# EAGLE design GanglionCarrierBoard (EAGLE 8.3.0)
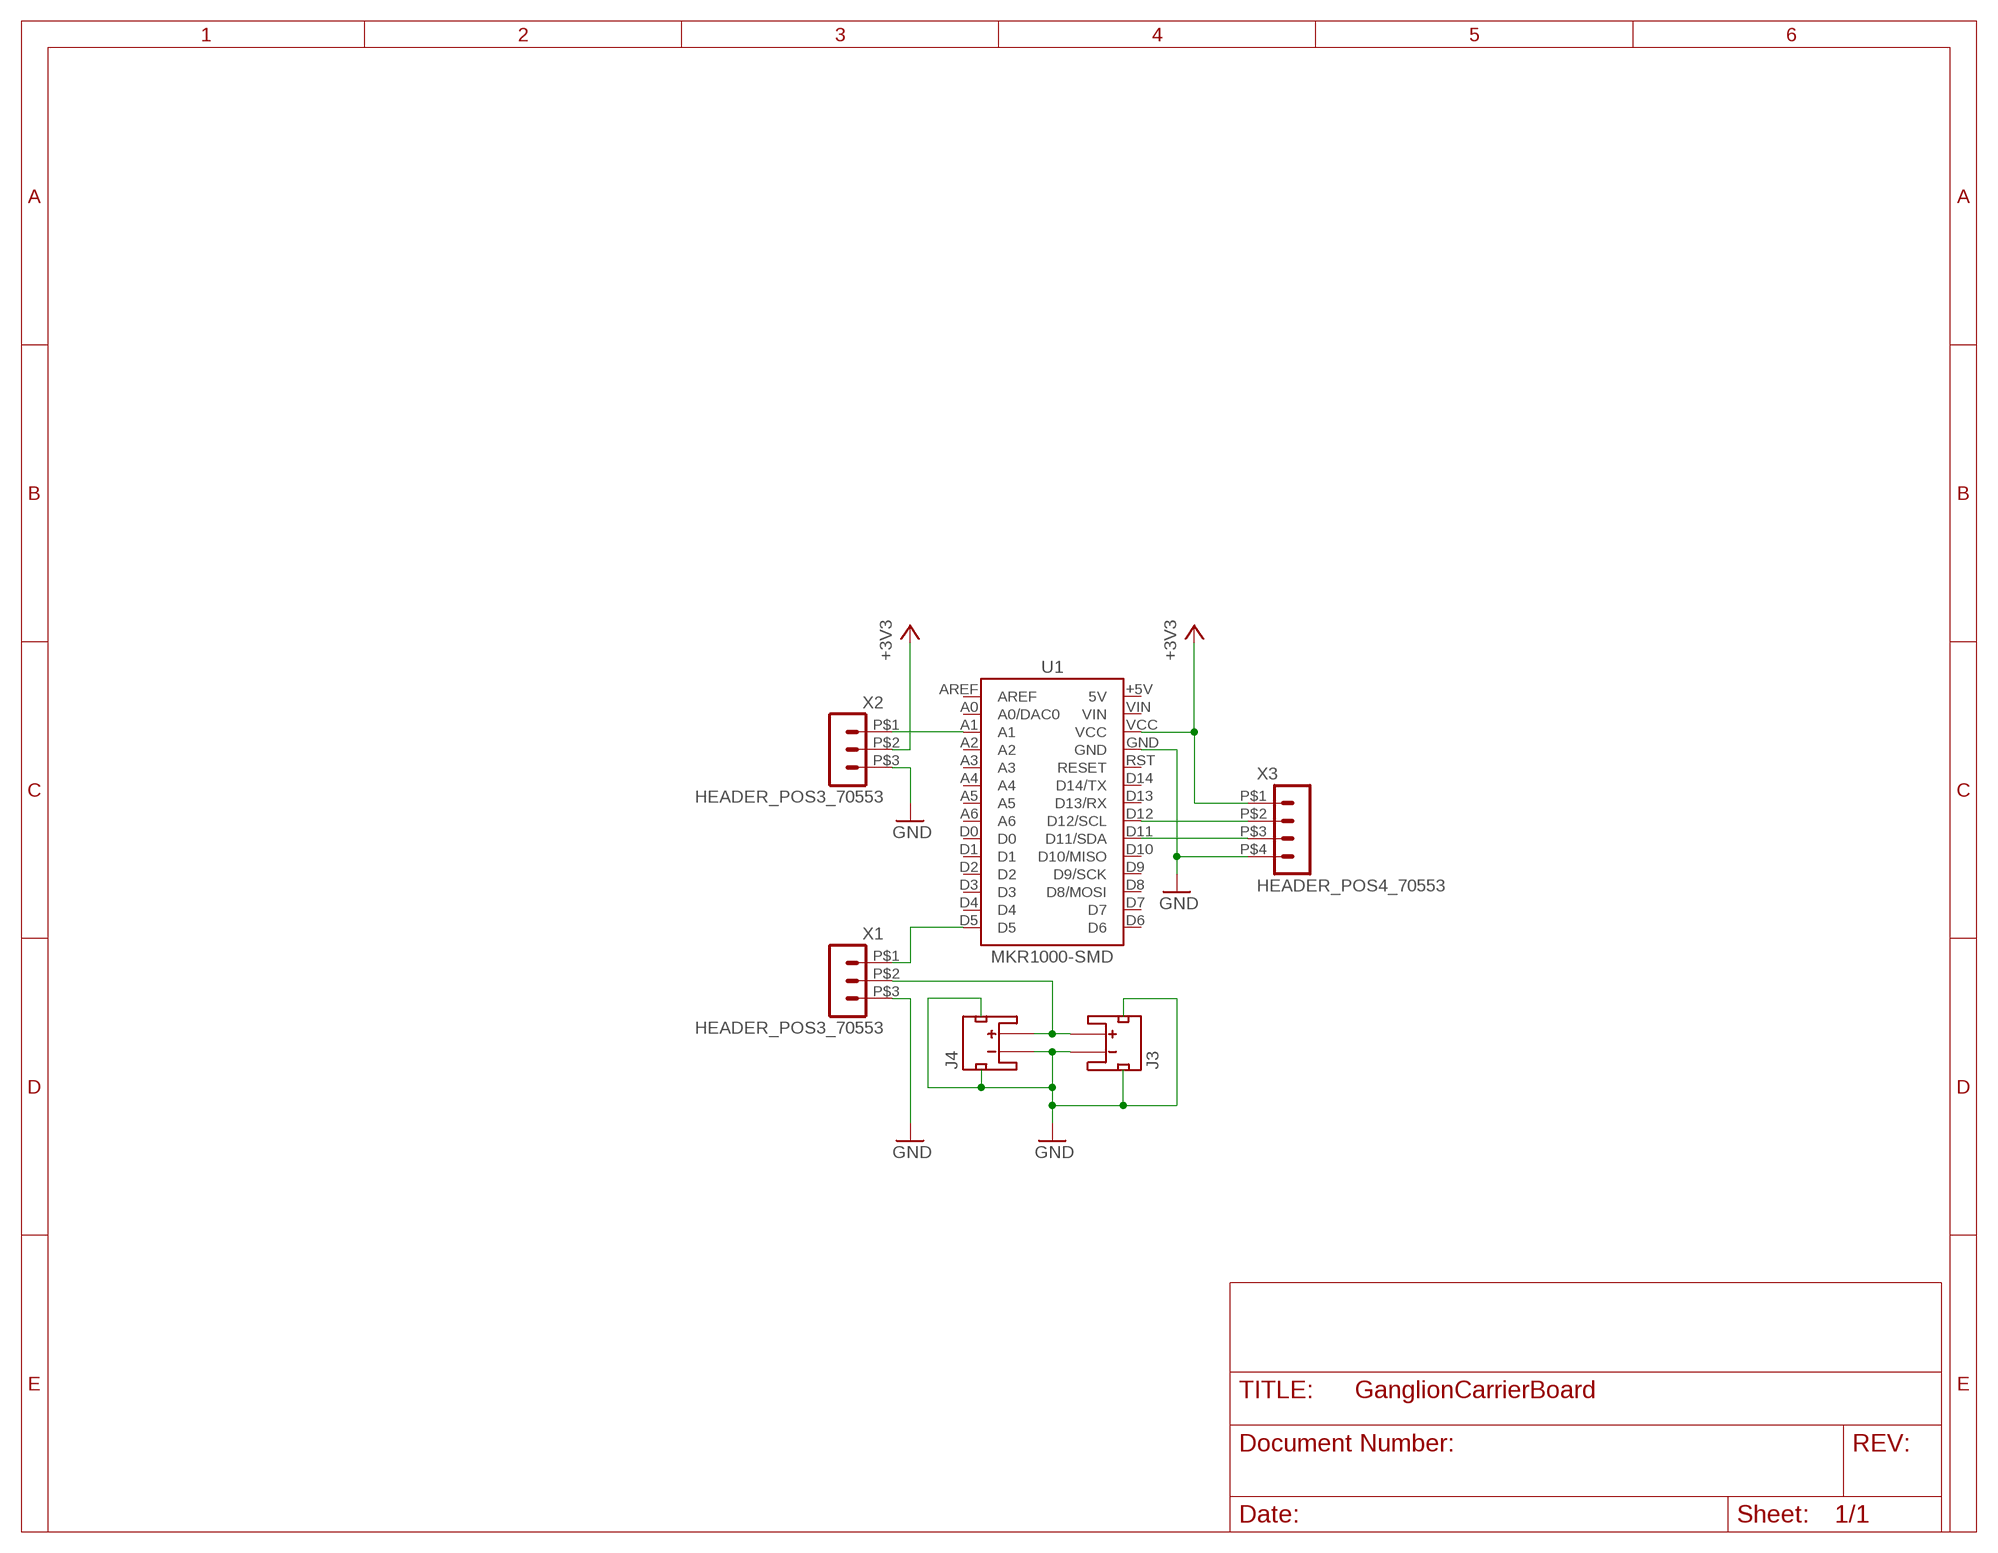
[diagram p0: schematic, sheet 1]

## Parts
J3  JST_2MM_MALE  [JST-2-SMD]
J4  JST_2MM_MALE  [JST-2-SMD]
U1  MKR1000-SMD  [MKR1000-SMD]
X1  HEADER_POS3_70553  [70553-POS3]
X2  HEADER_POS3_70553  [70553-POS3]
X3  HEADER_POS4_70553  [70553-POS4]

## Nets
+3V3: U1.VCC X2.P$2 X3.P$1
GND: J3.1(-) J3.NC1(PAD1) J3.NC2(PAD2) J4.1(-) J4.NC1(PAD1) J4.NC2(PAD2) U1.GND X1.P$3 X2.P$3 X3.P$4
N$1: U1.A1 X2.P$1
N$6: U1.D5 X1.P$1
N$7: J3.2(+) J4.2(+) X1.P$2
N$9: U1.D12(D12/SCL) X3.P$2
N$10: U1.D11(D11/SDA) X3.P$3
Unconnected: U1.+5V(5V) U1.A0(A0/DAC0) U1.A2 U1.A3 U1.A4 U1.A5 U1.A6 U1.AREF U1.D0 U1.D1 U1.D2 U1.D3 U1.D4 U1.D6 U1.D7 U1.D8(D8/MOSI) U1.D9(D9/SCK) U1.D10(D10/MISO) U1.D13(D13/RX) U1.D14(D14/TX) U1.RST(RESET) U1.VIN

## Library data of the parts
J3 J4 = SparkFun-Connectors:JST_2MM_MALE: JST 2MM MALE RA CONNECTOR Two pin, compact surface mount connector. Commonly used as a battery input connection point. We really like the solid locking feeling and high current rating on these small connectors. We use these all the time as battery connectors. Mates to single-cell LiPo batteries. Here is the connector we sell at SparkFun: JST Right Angle Connector - White <https://www.sparkfun.com/products/8612> (PRT-08612) Datasheet <http://www.sparkfun.com/datasheets/Prototyping/Connectors/JST-Horizontal.pdf> It was used on these SparkFun products: SparkFun MOSFET Power Controller <https://www.sparkfun.com/products/11214> (PRT-11214) SparkFun Battery Babysitter - LiPo Battery Manager <https://www.sparkfun.com/products/13777> (PRT-13777) And many, many others that required a lipo battery connection.; PROD_ID: CONN-11443; SF_ID: PRT-08612
U1 = arduino-shields:MKR
X1 X2 = con-molex-c-grid-sl:HEADER_POS3_?: Molex -C-Grid® / SL Series connector Wire-to-Board 2.54 mm (0.100") pitch header, 3 positions.
X3 = con-molex-c-grid-sl:HEADER_POS4_?: Molex -C-Grid® / SL Series connector Wire-to-Board 2.54 mm (0.100") pitch header, 4 positions.

## Board
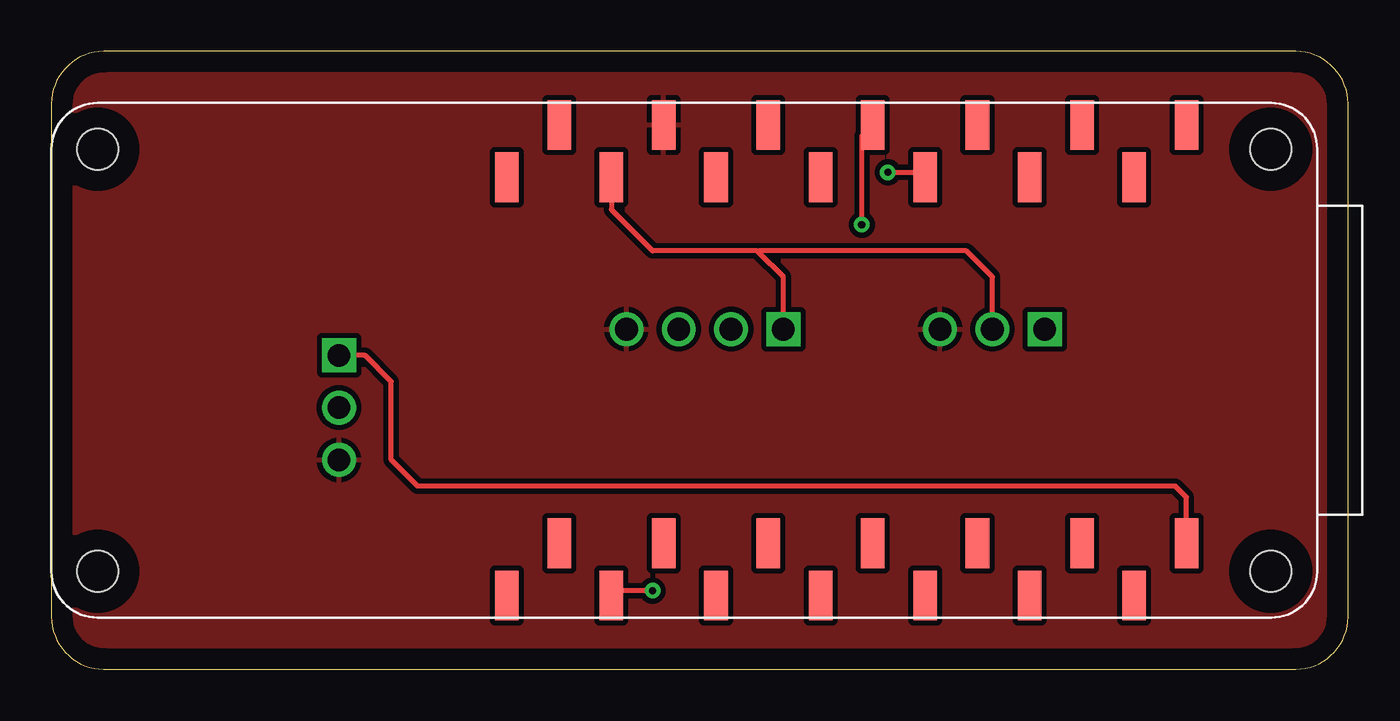
[diagram p1: board, top side]
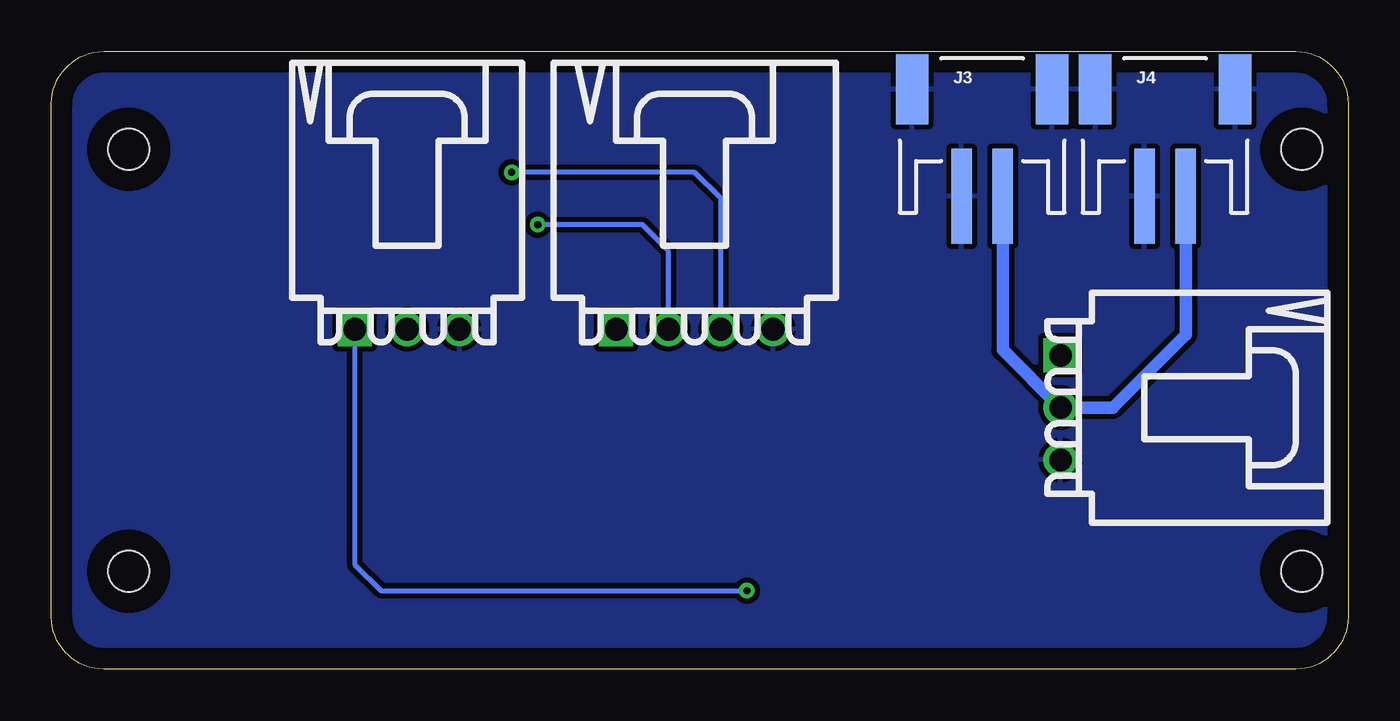
[diagram p2: board, bottom side, seen from below]

Size 63 x 30 mm. Coordinates in mm from the lower left corner, seen from the top.
Outline: 0,27.46 0,2.54 arc90 2.54,0 60.46,0 arc90 63,2.54 63,27.46 arc90 60.46,30 2.54,30 arc90 0,27.46
Copper layers (1*16): Top 0.035mm / dielectric 1.5mm / Bottom 0.035mm
Design rules "default": minimum track width 6mil, minimum drill 0.35mm, track to track 6mil, track to pad 6mil, pad to pad 6mil, via to via 6mil, smd to smd 6mil, copper to edge 40mil, drill to drill 6mil, minimum pad ring 10mil, minimum via ring 8mil, stop-mask expansion 4mil, vias tented up to drill 0mil, thermal gap 10mil

### Footprints (pad centres in the part's own frame; a part is rotated, then mirrored left to right if it is on the bottom)
JST-2-SMD = smd 1 x 4.6: 1 -1,-3.7; 2 1,-3.7 | smd 1.6 x 3.4: NC1 -3.4,1.5; NC2 3.4,1.5
MKR1000-SMD = smd 1.143 x 2.413: +5V 39.37,-8.89; A0 36.83,8.89; A1 34.29,11.43; A2 31.75,8.89; A3 29.21,11.43; A4 26.67,8.89; A5 24.13,11.43; A6 21.59,8.89; AREF 39.37,11.43; D0 19.05,11.43; D1 16.51,8.89; D2 13.97,11.43; D3 11.43,8.89; D4 8.89,11.43; D5 6.35,8.89; D6 6.35,-11.43; D7 8.89,-8.89; D8 11.43,-11.43; D9 13.97,-8.89; D10 16.51,-11.43; D11 19.05,-8.89; D12 21.59,-11.43; D13 24.13,-8.89; D14 26.67,-11.43; GND 31.75,-11.43; RST 29.21,-8.89; VCC 34.29,-8.89; VIN 36.83,-11.43 | hole 2: 2.25,10.25; 2.25,-10.25; 59.25,-10.25; 59.25,10.25
70553-POS3 = drill 1.1 square: P$1 -2.54,0 | drill 1.1: P$2 0,0; P$3 2.54,0
70553-POS4 = drill 1.1 square: P$1 -3.81,0 | drill 1.1: P$2 -1.27,0; P$3 1.27,0; P$4 3.81,0

### Placement (x,y rotation side)
J3  17.78,26.67 0 bottom
J4  8.89,26.67 0 bottom
U1  61.5,15 180 top
X1  13.97,12.7 270 bottom
X2  45.72,16.51 0 bottom
X3  31.75,16.51 0 bottom

### Tracks (layer width: path | path; a pad name or v marks a point on that pad's centre or on a via)
+3V3
  Top 0.254: X3.P$1 35.56,19.05 34.33,20.28 | 34.33,20.28 34.29,20.32 29.21,20.32 28.48,21.05 | 28.48,21.05 27.94,21.59 | U1.VCC 27.21,22.32 28.48,21.05 | X2.P$2 45.72,19.05 44.45,20.32 34.37,20.32 34.33,20.28
GND
  pour Top (isolate 0.254): -2.54,-2.54 87.63,-2.54 87.63,33.02 -2.54,33.02
  pour Bottom (isolate 0.254): -1.27,-1.27 86.36,-1.27 86.36,31.75 -1.27,31.75
N$1  (via drill 0.35)
  Top 0.254: v29.21,3.81 27.45,3.81 U1.A1
  Bottom 0.254: X2.P$1 48.26,5.08 46.99,3.81 v29.21,3.81
N$6
  Top 0.254: U1.D5 55.15,8.35 54.61,8.89 17.78,8.89 16.51,10.16 16.51,13.97 15.24,15.24 X1.P$1
N$7
  Bottom 0.61: J3.2 16.78,15.51 X1.P$2 11.43,12.7 7.89,16.24 J4.2
N$9  (via drill 0.35)
  Top 0.254: v39.37,21.59 39.37,25.89 U1.D12
  Bottom 0.254: X3.P$2 33.02,20.32 34.29,21.59 v39.37,21.59
N$10  (via drill 0.35)
  Top 0.254: v40.64,24.13 42.21,24.13 U1.D11
  Bottom 0.254: X3.P$3 30.48,22.86 31.75,24.13 v40.64,24.13